# EAGLE design lumyctrl (EAGLE 6.1)
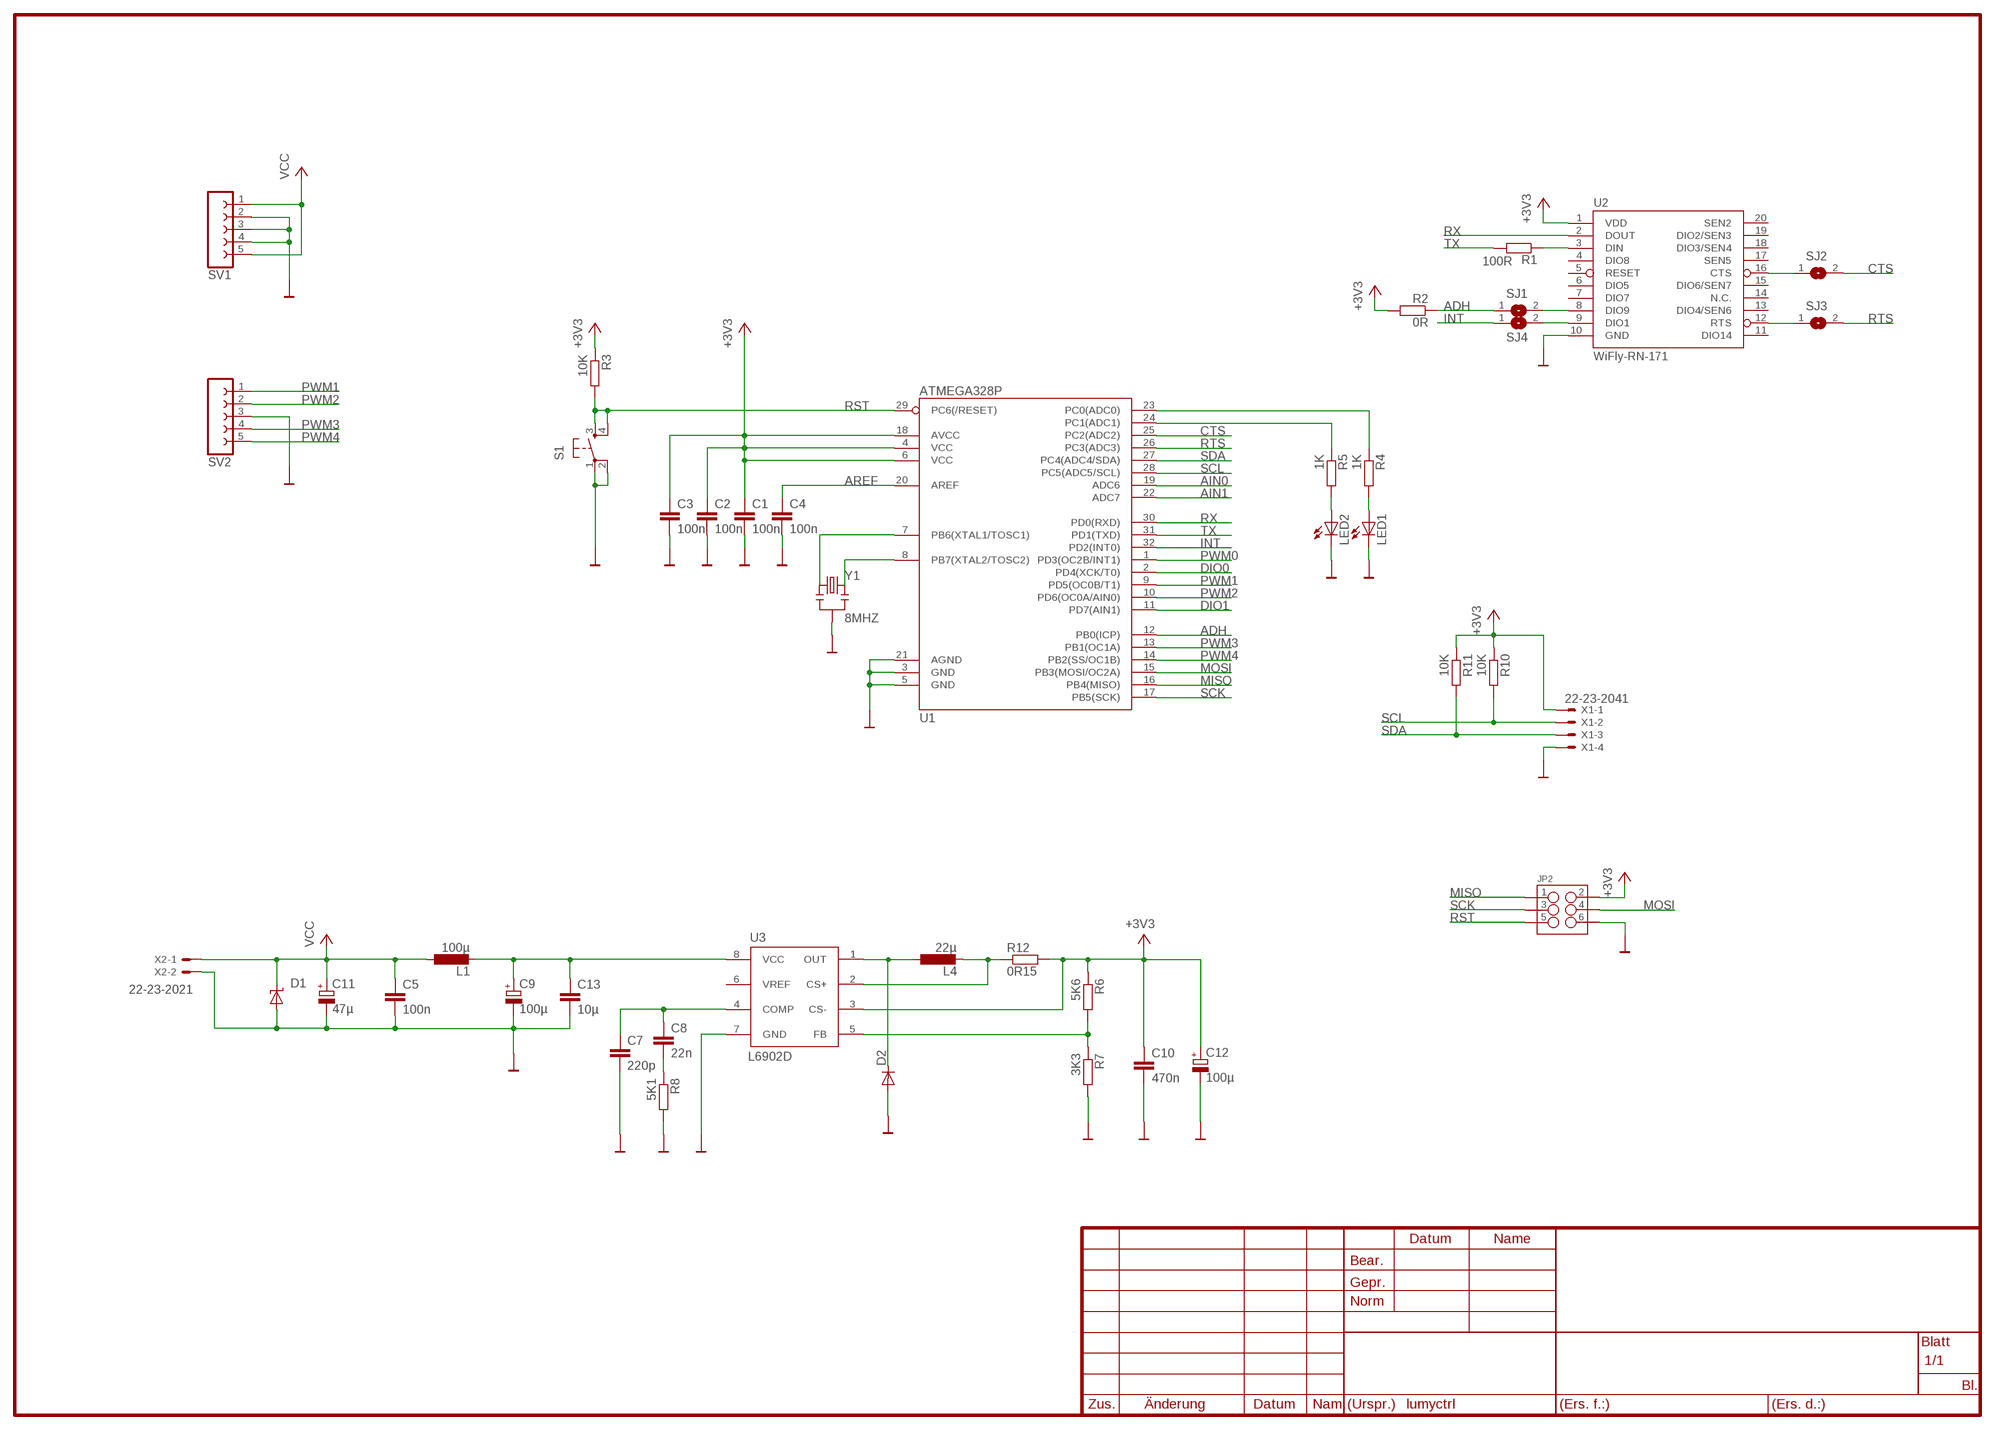
[diagram p0: schematic, sheet 1]

## Parts
C1  100n  C-EUC0603  [C0603]
C2  100n  C-EUC0603  [C0603]
C3  100n  C-EUC0603  [C0603]
C4  100n  C-EUC0603  [C0603]
C5  100n  C-EUC0603  [C0603]
C7  220p  C-EUC0603  [C0603]
C8  22n  C-EUC0603  [C0603]
C9  100µ  CPOL-EUSMCC  [SMC_C]
C10  470n  C-EUC0603  [C0603]
C11  47µ  CPOL-EUSMCE  [SMC_E]
C12  100µ  CPOL-EUSMCC  [SMC_C]
C13  10µ  C-EUC1206  [C1206]
D1  SUPPRESSOR-SMBJ  [SMBJ]
D2  DIODESMA  [SMA-DIODE]
JP2  M03X2SMT  [2X3_SMT_POSTS]
L1  100µ  L-EUWE-TPC  [POWER-CHOKE_WE-TPC]
L4  22µ  L-EUWE-TPC  [POWER-CHOKE_WE-TPC]
LED1  LEDCHIP-LED0603  [CHIP-LED0603]
LED2  LEDCHIP-LED0603  [CHIP-LED0603]
R1  100R  R-EU_R0603  [R0603]
R2  0R  R-EU_R0603  [R0603]
R3  10K  R-EU_R0603  [R0603]
R4  1K  R-EU_R0603  [R0603]
R5  1K  R-EU_R0603  [R0603]
R6  5K6  R-EU_R0603  [R0603]
R7  3K3  R-EU_R0603  [R0603]
R8  5K1  R-EU_R0603  [R0603]
R10  10K  R-EU_R0603  [R0603]
R11  10K  R-EU_R0603  [R0603]
R12  0R15  R-EU_R2512  [R2512]
S1  TAC_SWITCHSMD  [TACTILE_SWITCH_SMD]
SJ1  SJ  [SJ]
SJ2  SJ  [SJ]
SJ3  SJ  [SJ]
SJ4  SJ  [SJ]
SV1  FE05-1  [FE05-1]
SV2  FE05-1  [FE05-1]
U1  ATMEGA328P  ATMEGA328_SMT  [TQFP32-08]
U2  WiFly-RN-171  XBEE-1B3  [XBEE-SMD]
U3  L6902D  [SO08]
X1  22-23-2041  [22-23-2041]
X2  22-23-2021  [22-23-2021]
Y1  8MHZ  RESONATOR8MHZ  [RESONATOR-SMD]

## Nets
+3V3: C1.1 C2.1 C3.1 C10.1 C12.+ JP2.2 R2.2 R3.1 R6.1 R10.1 R11.1 R12.2 U1.4(VCC) U1.6(VCC) U1.18(AVCC) U2.1(VDD) U3.3(CS-) X1.1
ADH: R2.1 SJ1.1 U1.12(PB0(ICP))
AIN0: U1.19(ADC6)
AIN1: U1.22(ADC7)
AREF: C4.1 U1.20(AREF)
CTS: SJ2.2 U1.25(PC2(ADC2))
DIO0: U1.2(PD4(XCK/T0))
DIO1: U1.11(PD7(AIN1))
GND: C1.2 C2.2 C3.2 C4.2 C5.2 C7.2 C9.- C10.2 C11.- C12.- C13.2 D1.A D2.A JP2.6 LED1.C LED2.C R7.2 R8.2 S1.1 S1.2 SV1.2 SV1.3 SV1.4 SV2.3 U1.3(GND) U1.5(GND) U1.21(AGND) U2.10(GND) X1.4 X2.2 Y1.2
INT: SJ4.1 U1.32(PD2(INT0))
MISO: JP2.1 U1.16(PB4(MISO))
MOSI: JP2.4 U1.15(PB3(MOSI/OC2A))
N$1: R1.1 U2.3(DIN)
N$2: SJ1.2 U2.8(DIO9)
N$3: D2.C L4.1 U3.1(OUT)
N$4: U1.7(PB6(XTAL1/TOSC1)) Y1.1
N$5: U1.8(PB7(XTAL2/TOSC2)) Y1.3
N$6: SJ3.1 U2.12(RTS)
N$7: SJ2.1 U2.16(CTS)
N$8: R6.2 R7.1 U3.5(FB)
N$9: C9.+ C13.1 L1.2 U3.8(VCC)
N$10: C7.1 C8.1 U3.4(COMP)
N$11: LED2.A R5.2
N$12: C8.2 R8.1
N$13: LED1.A R4.2
N$14: R4.1 U1.23(PC0(ADC0))
N$15: R5.1 U1.24(PC1(ADC1))
N$16: L4.2 R12.1 U3.2(CS+)
N$17: SJ4.2 U2.9(DIO1)
PWM0: U1.1(PD3(OC2B/INT1))
PWM1: SV2.1 U1.9(PD5(OC0B/T1))
PWM2: SV2.2 U1.10(PD6(OC0A/AIN0))
PWM3: SV2.4 U1.13(PB1(OC1A))
PWM4: SV2.5 U1.14(PB2(SS/OC1B))
RST: JP2.5 R3.2 S1.3 S1.4 U1.29(PC6(/RESET))
RTS: SJ3.2 U1.26(PC3(ADC3))
RX: U1.30(PD0(RXD)) U2.2(DOUT)
SCK: JP2.3 U1.17(PB5(SCK))
SCL: R10.2 U1.28(PC5(ADC5/SCL)) X1.2
SDA: R11.2 U1.27(PC4(ADC4/SDA)) X1.3
TX: R1.2 U1.31(PD1(TXD))
VCC: C5.1 C11.+ D1.C L1.1 SV1.1 SV1.5 X2.1
Unconnected: U2.4(DIO8) U2.5(RESET) U2.6(DIO5) U2.7(DIO7) U2.11(DIO14) U2.13(DIO4/SEN6) U2.14(N.C.) U2.15(DIO6/SEN7) U2.17(SEN5) U2.18(DIO3/SEN4) U2.19(DIO2/SEN3) U2.20(SEN2) U3.6(VREF)

## Power pins joined to a net without a drawn wire
GND: U3.7(GND)

## Library data of the parts
C1-C5 C7 C8 C10 C13 = rcl:C-EU: CAPACITOR, European symbol
C9 C11 C12 = rcl:CPOL-EU: POLARIZED CAPACITOR, European symbol
D1 = diode:SUPPRESSOR-: Suppressor diode
D2 = SparkFun-DiscreteSemi:DIODE: Diode These are standard reverse protection diodes and small signal diodes. SMA package can handle up to about 1A. SOD-323 can handle about 200mA. What the SOD-323 package when ordering, there are some mfgs out there that are 5-pin packages.
JP2 = SparkFun-Connectors:M03X2: 2x3 .1" header. Shrouded, with keying- CONN-10681 SMT- CONN-11415 Pogo pins- HW-11044; PROD_ID: CONN-11415
L1 L4 = rcl:L-EU: INDUCTOR, European symbol
LED1 LED2 = led:LED: LED OSRAM: - CHIPLED LG R971, LG N971, LY N971, LG Q971, LY Q971, LO R971, LY R971 LH N974, LH R974 LS Q976, LO Q976, LY Q976 LO Q996 - Hyper CHIPLED LW Q18S LB Q993, LB Q99A, LB R99A - SideLED LS A670, LO A670, LY A670, LG A670, LP A670 LB A673, LV A673, LT A673, LW A673 LH A674 LY A675 LS A676, LA A676, LO A676, LY A676, LW A676 LS A679, LY A679, LG A679 - Hyper Micro SIDELED® LS Y876, LA Y876, LO Y876, LY Y876 LT Y87S - SmartLED LW L88C, LW L88S LB L89C, LB L89S, LG L890 LS L89K, LO L89K, LY L89K LS L896, LA L896, LO L896, LY L896 - TOPLED LS T670, LO T670, LY T670, LG T670, LP T670 LSG T670, LSP T670, LSY T670, LOP T670, LYG T670 LG T671, LOG T671, LSG T671 LB T673, LV T673, LT T673, LW T673 LH T674 LS T676, LA T676, LO T676, LY T676, LB T676, LH T676, LSB T676, LW T676 LB T67C, LV T67C, LT T67C, LS T67K, LO T67K, LY T67K, LW E67C LS E67B, LA E67B, LO E67B, LY E67B, LB E67C, LV E67C, LT E67C LW T67C LS T679, LY T679, LG T679 LS T770, LO T770, LY T770, LG T770, LP T770 LB T773, LV T773, LT T773, LW T773 LH T774 LS E675, LA E675, LY E675, LS T675 LS T776, LA T776, LO T776, LY T776, LB T776 LHGB T686 LT T68C, LB T68C - Hyper Mini TOPLED® LB M676 - Mini TOPLED Santana® LG M470 LS M47K, LO M47K, LY M47K Source: http://www.osram.convergy.de LUXEON: - LUMILED® LXK2-PW12-R00, LXK2-PW12-S00, LXK2-PW14-U00, LXK2-PW14-V00 LXK2-PM12-R00, LXK2-PM12-S00, LXK2-PM14-U00 LXK2-PE12-Q00, LXK2-PE12-R00, LXK2-PE12-S00, LXK2-PE14-T00, LXK2-PE14-U00 LXK2-PB12-K00, LXK2-PB12-L00, LXK2-PB12-M00, LXK2-PB14-N00, LXK2-PB14-P00, LXK2-PB14-Q00 LXK2-PR12-L00, LXK2-PR12-M00, LXK2-PR14-Q00, LXK2-PR14-R00 LXK2-PD12-Q00, LXK2-PD12-R00, LXK2-PD12-S00 LXK2-PH12-R00, LXK2-PH12-S00 LXK2-PL12-P00, LXK2-PL12-Q00, LXK2-PL12-R00 Source: www.luxeon.com KINGBRIGHT: KA-3528ASYC Source: www.kingbright.com
R1-R8 R10 R11 = resistor:R-EU_: RESISTOR, European symbol
R12 = rcl:R-EU_: RESISTOR, European symbol
S1 = SparkFun-Electromechanical:TAC_SWITCH: Momentary Switch Button commonly used for reset or general input. Spark Fun Electronics SKU : COM-00097 SMT- SWCH-08247; PROD_ID: SWCH-08247
SJ1-SJ4 = jumper:SJ: SMD solder JUMPER
SV1 SV2 = con-lsta:FE05-1: FEMALE HEADER; OC_FARNELL: unknown; OC_NEWARK: unknown
U1 = SparkFun-DigitalIC:ATMEGA328_SMT: 32-Pin Atmega328 part Commonly used on Arduino compatible boards Available in QFP and QFN packages TQFP is IC-09069 QFN is non-stock; PROD_ID: IC-09069
U2 = SparkFun-RF:XBEE-1: Xbee module footprints SMT header is CONN-09042.; PROD_ID: CONN-09042
U3 = st-microelectronics-2:L6902D: 1A Switching Regulator with adjustable Current Limit
X1 = con-molex:22-23-2041: .100" (2.54mm) Center Header - 4 Pin; MF: MOLEX; MPN: 22-23-2041; OC_FARNELL: 1462920; OC_NEWARK: 38C0355
X2 = con-molex:22-23-2021: .100" (2.54mm) Center Header - 2 Pin; MF: MOLEX; MPN: 22-23-2021; OC_FARNELL: 1462926; OC_NEWARK: 25C3832
Y1 = SparkFun-FreqCtrl:RESONATOR: Resonator Small SMD resonator. Used, eg, on the Arduino Pro/ Pro Mini boards. 8MHz- XTAL-08895 16MHz- XTAL-08900; PROD_ID: XTAL-08895

## Board
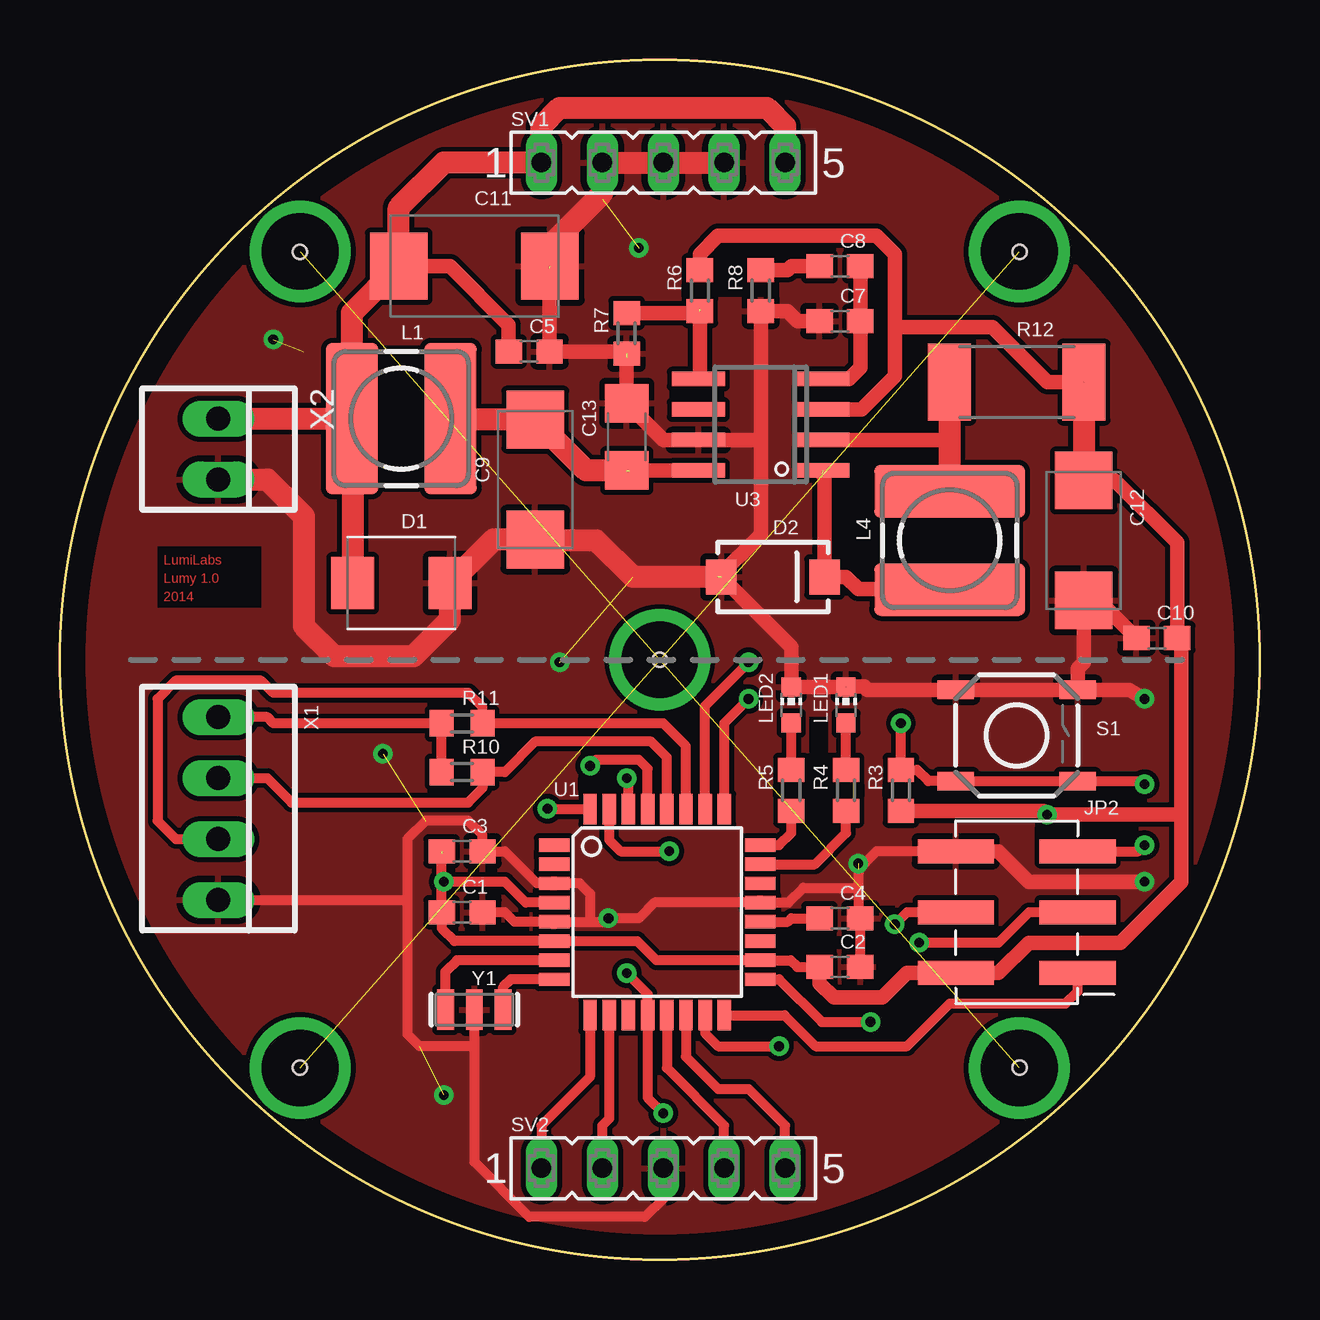
[diagram p1: board, top side]
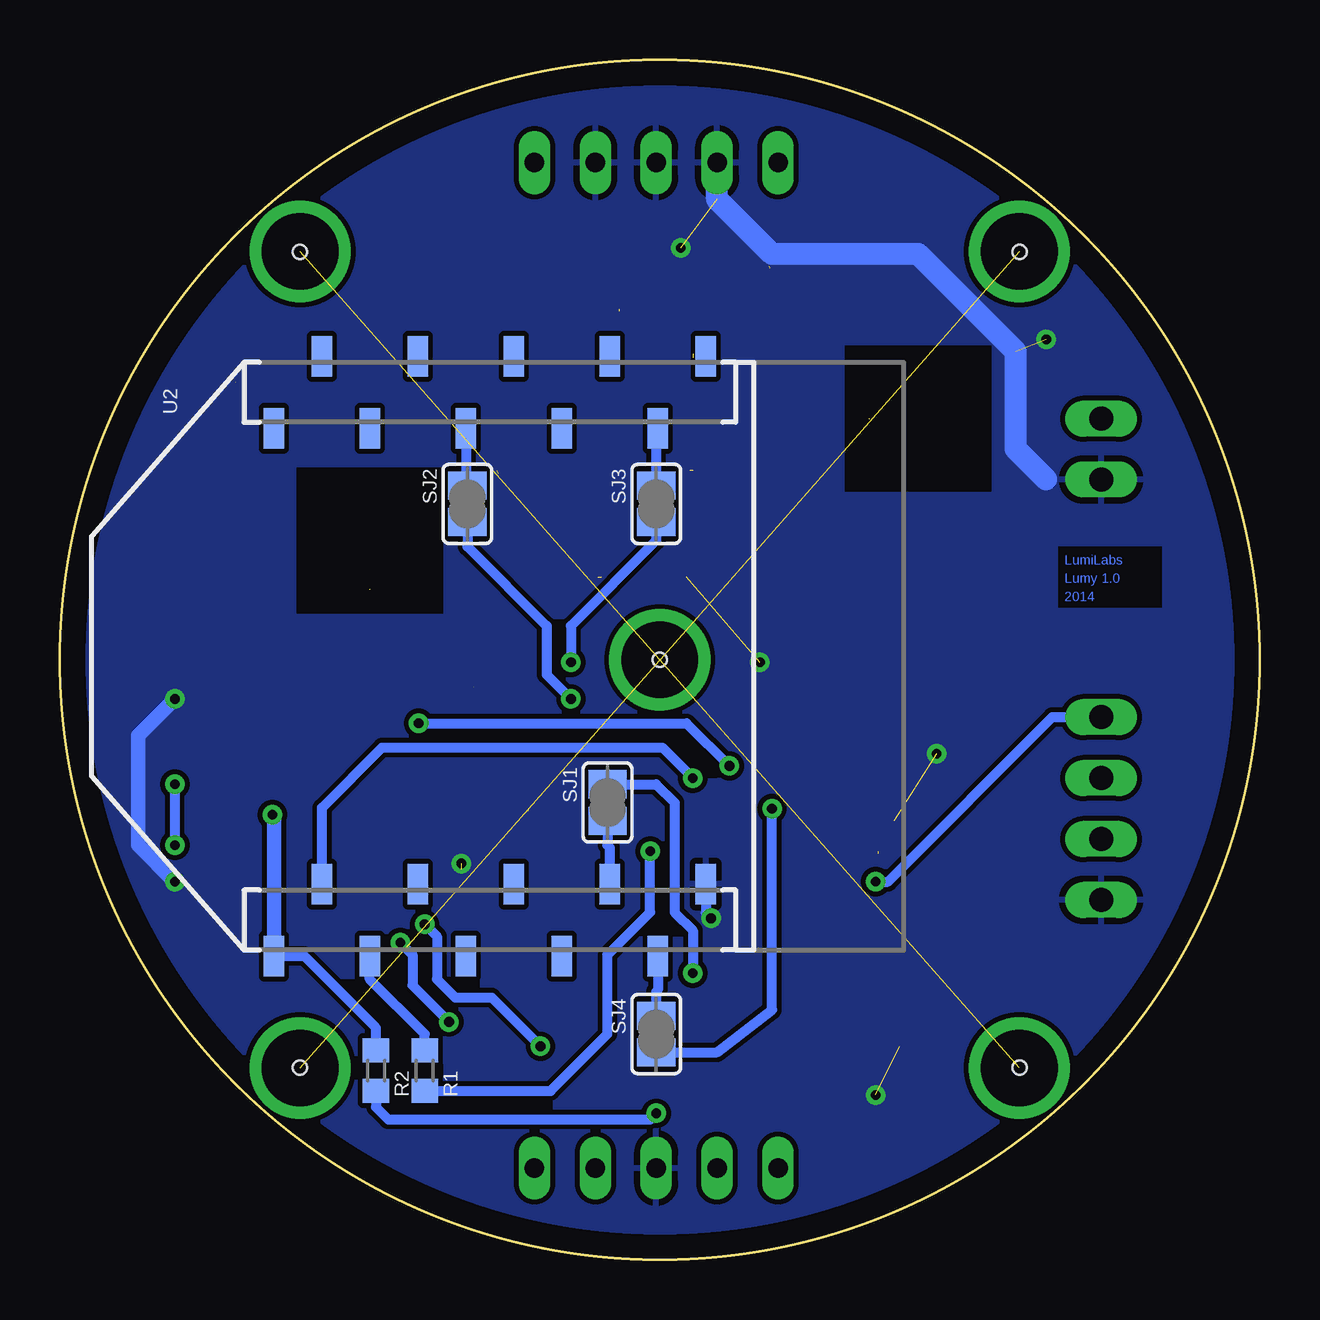
[diagram p2: board, bottom side, seen from below]

Size 50 x 50 mm. Coordinates in mm from the lower left corner, seen from the top.
Outline: circle at 25,25 radius 25
Copper layers (1*16): Top 0.035mm / dielectric 1.5mm / Bottom 0.035mm
Design rules: minimum track width 10mil, minimum drill 10mil, track to track 8mil, track to pad 8mil, pad to pad 8mil, via to via 8mil, smd to smd 8mil, copper to edge 40mil, drill to drill 8mil, minimum pad ring 10mil, minimum via ring 8mil, stop-mask expansion 4mil, vias tented up to drill 0mil, thermal gap 10mil
Holes 0.6 mm at 25,25 40,8 10,8 10,42 40,42
tRestrict: area 4.1,27.2 to 8.4,29.7; area 11.2,32 to 17.3,38.1; area 34,26.9 to 40.1,33; area 16.8,11.4 to 18,11.9; area 18.5,13.7 to 19.6,14.5; area 34,11.9 to 34.8,13.5; area 30.2,13 to 34,13.5; area 34.3,14.5 to 34.8,14.7; area 40.6,17.5 to 45,18; area 34.3,19.3 to 36.6,19.8; area 28.4,10.7 to 30.2,11.2; area 28.2,10.7 to 28.4,10.9; area 30.5,33 to 36.6,33.8; area 30.5,35.8 to 33.3,36.3; area 25.9,40.1 to 30,40.6; area 30.5,34.5 to 33.3,35.1; area 29.7,19.3 to 33.5,19.8; area 31.2,19.8 to 32,22.6; area 21.6,19.6 to 22.6,20.1; area 25.4,35.8 to 27.7,36.3
bRestrict: area 4.1,27.2 to 8.4,29.7; area 34,26.9 to 40.1,33; area 11.2,32 to 17.3,38.1; area 24.6,13.5 to 25.1,16.8; area 24.1,13.5 to 24.6,14; area 24.1,21.6 to 34.8,22.1; area 22.6,20.1 to 23.1,20.6; area 29,25.1 to 29.5,26.7; area 34,7.6 to 37.3,8.1; area 37.6,11.4 to 38.4,11.7; area 29.5,6.1 to 34,6.9; area 32.5,11.2 to 33.5,11.7

### Footprints (pad centres in the part's own frame; a part is rotated, then mirrored left to right if it is on the bottom)
C0603 = smd 1.1 x 1: 1 -0.85,0; 2 0.85,0
SMC_C = smd 2.4 x 2.4: + -2.5,0; - 2.5,0
SMC_E = smd 2.4 x 2.8: + -3.15,0; - 3.15,0
C1206 = smd 1.6 x 1.8: 1 -1.4,0; 2 1.4,0
SMBJ = smd 1.78 x 2.16: A 2.04,0; C -2.03,0
SMA-DIODE = smd 1.27 x 1.47: A -2.15,0; C 2.15,0
2X3_SMT_POSTS = smd 1 x 3.17: 1 -2.54,-2.54; 2 -2.54,2.54; 3 0,-2.54; 4 0,2.54; 5 2.54,-2.54; 6 2.54,2.54
POWER-CHOKE_WE-TPC = smd 6.3 x 2.2: 1 0,2.05; 2 0,-2.05
CHIP-LED0603 = smd 0.8 x 0.8: A 0,-0.75; C 0,0.75
R0603 = smd 1 x 1.1: 1 -0.85,0; 2 0.85,0
R2512 = smd 1.8 x 3.2: 1 -2.8,0; 2 2.8,0
TACTILE_SWITCH_SMD = smd 1.524 x 0.762: 1 -2.54,1.905; 2 2.54,1.905; 3 -2.54,-1.905; 4 2.54,-1.905
SJ = smd 1.168 x 1.6: 1 -0.762,0; 2 0.762,0
FE05-1 = drill 0.813 long: 1 -5.08,0; 2 -2.54,0; 3 0,0; 4 2.54,0; 5 5.08,0
TQFP32-08 = smd 1.27 x 0.559: 1 -4.293,2.8; 2 -4.293,2; 3 -4.293,1.2; 4 -4.293,0.4; 5 -4.293,-0.4; 6 -4.293,-1.2; 7 -4.293,-2; 8 -4.293,-2.8; 17 4.293,-2.8; 18 4.293,-2; 19 4.293,-1.2; 20 4.293,-0.4; 21 4.293,0.4; 22 4.293,1.2; 23 4.293,2; 24 4.293,2.8 | smd 0.559 x 1.27: 9 -2.8,-4.293; 10 -2,-4.293; 11 -1.2,-4.293; 12 -0.4,-4.293; 13 0.4,-4.293; 14 1.2,-4.293; 15 2,-4.293; 16 2.8,-4.293; 25 2.8,4.293; 26 2,4.293; 27 1.2,4.293; 28 0.4,4.293; 29 -0.4,4.293; 30 -1.2,4.293; 31 -2,4.293; 32 -2.8,4.293
XBEE-SMD = smd 1.7 x 0.85: 1 -12.5,20; 2 -9.5,18; 3 -12.5,16; 4 -9.5,14; 5 -12.5,12; 6 -9.5,10; 7 -12.5,8; 8 -9.5,6; 9 -12.5,4; 10 -9.5,2; 11 12.5,2; 12 9.5,4; 13 12.5,6; 14 9.5,8; 15 12.5,10; 16 9.5,12; 17 12.5,14; 18 9.5,16; 19 12.5,18; 20 9.5,20
SO08 = smd 0.6 x 2.2: 1 -1.905,-2.6; 2 -0.635,-2.6; 3 0.635,-2.6; 4 1.905,-2.6; 5 1.905,2.6; 6 0.635,2.6; 7 -0.635,2.6; 8 -1.905,2.6
22-23-2041 = drill 1 long: 1 -3.81,0; 2 -1.27,0; 3 1.27,0; 4 3.81,0
22-23-2021 = drill 1 long: 1 -1.27,0; 2 1.27,0
RESONATOR-SMD = smd 0.7 x 1.7: 1 -1.2,0; 2 0,0; 3 1.2,0

### Placement (x,y rotation side)
C1  16.76,14.48 0 top
C2  32.51,12.19 0 top
C3  16.76,17.02 0 top
C4  32.51,14.22 0 top
C5  19.56,37.85 0 top
C7  32.51,39.12 180 top
C8  32.51,41.4 180 top
C9  19.81,32.51 270 top
C10  45.72,25.91 180 top
C11  17.27,41.4 0 top
C12  42.67,29.97 270 top
C13  23.62,34.29 90 top
D1  14.22,28.19 0 top
D2  29.72,28.45 0 top
JP2  39.88,14.48 90 top
L1  14.22,35.05 90 top
L4  37.08,29.97 180 top
LED1  32.77,23.11 0 top
LED2  30.48,23.11 0 top
R1  34.8,7.87 270 bottom
R2  36.83,7.87 90 bottom
R3  35.05,19.56 90 top
R4  32.77,19.56 90 top
R5  30.48,19.56 90 top
R6  26.67,40.39 270 top
R7  23.62,38.61 270 top
R8  29.21,40.39 270 top
R10  16.76,20.32 0 top
R11  16.76,22.35 0 top
R12  39.88,36.58 0 top
S1  39.88,21.84 0 top
SJ1  27.18,19.05 270 bottom
SJ2  33.02,31.5 270 bottom
SJ3  25.15,31.5 270 bottom
SJ4  25.15,9.4 90 bottom
SV1  25.15,45.72 0 top
SV2  25.15,3.81 0 top
U1  24.89,14.48 0 top
U2  21.08,25.15 90 bottom
U3  29.21,34.8 90 top
X1  6.6,18.8 270 top
X2  6.6,33.78 270 top
Y1  17.27,10.41 0 top

### Tracks (layer width: path | path; a pad name or v marks a point on that pad's centre or on a via)
+3V3  (via drill 0.41)  (2 unrouted)
  Top 0.406: C2.1 30.73,12.19 30.45,12.48 U1.18 24.86,12.48 24.06,13.28 U1.6 16.44,13.28 15.91,13.8 C1.1 15.91,15.75 | U1.4 19.41,14.88 18.54,15.75 v16,15.75 15.91,15.75 | 16,17.02 15.91,16.93 15.91,15.75 | X1.1 8.64,22.61 8.89,22.35 R11.1 R10.1
  Top 0.61: R6.1 26.67,41.91 27.43,42.67 34.04,42.67 34.8,41.91 34.8,38.86 | U3.3 33.4,35.43 34.8,36.83 34.8,38.86 | 34.8,38.86 38.86,38.86 41.15,36.58 R12.2 | C12.+ 43.98,32.48 46.57,29.88 C10.1 46.74,25.74 46.74,18.54 | 46.74,18.54 v41.15,18.54 40.98,18.71 R3.1 | 46.74,18.54 46.74,15.75 44.2,13.21 40.39,13.21 39.12,11.94 JP2.2 35.31,11.94 34.29,10.92 32.26,10.92 31.66,11.52 C2.1
  Top 0.813: C12.+
  Top 0.914: R12.2 C12.+
  Bottom 0.406: v16,15.75 15.49,15.75 8.64,22.61 X1.1 | R2.2 36.83,9.65 39.82,12.65 U2.1
  Bottom 0.61: U2.1 41.08,18.48 v41.15,18.54
ADH  (via drill 0.41)
  Top 0.406: v25.15,6.1 24.49,6.75 U1.12 24.49,11.07 v23.62,11.94
  Bottom 0.406: SJ1.1 25.15,19.81 24.38,19.05 24.38,14.48 23.62,13.72 v23.62,11.94 | R2.1 36.83,6.35 36.32,5.84 25.4,5.84 v25.15,6.1
AREF
  Top 0.406: U1.20 30.33,14.08 30.48,14.22 C4.1
CTS  (via drill 0.41)
  Top 0.406: U1.25 27.69,22.36 v28.7,23.37
  Bottom 0.406: SJ2.2 33.02,29.72 29.72,26.42 29.72,24.38 v28.7,23.37
GND  (via drill 0.41)  (10 unrouted)
  Top 0.406: JP2.6 34.04,17.02 33.27,16.26 33.27,15.49 | 33.27,15.49 33.27,14.31 C4.2 C2.2 | 22.1,14.08 U1.5 18.94,14.08 18.54,14.48 C1.2 | 22.1,14.08 22.71,14.08 v22.86,14.22 24.13,14.22 24.78,14.88 U1.21 30.37,14.88 30.99,15.49 33.27,15.49 | 22.1,14.08 22.1,15.24 21.66,15.68 U1.3 19.88,15.68 18.54,17.02 C3.2 17.61,17.69 17.02,18.29 15.24,18.29 14.48,17.53 14.48,14.99 | 14.48,14.99 14.48,9.4 14.99,8.89 17.27,8.89 | SV2.3 25.15,2.54 24.38,1.78 19.56,1.78 17.27,4.06 17.27,8.89 | 17.27,8.89 Y1.2 | X1.4 14.48,14.99
  Top 0.61: C5.2 23.37,37.85 23.62,37.59 C13.2 25.15,34.16 U3.7 29.08,34.16 29.21,34.04 | C5.2 20.57,37.85 | C5.2 20.41,41.31 | 29.21,34.04 R8.2 30.31,39.54 30.73,39.12 C7.2 | 29.21,34.04 29.21,30.23 27.43,28.45 | C12.- 42.67,24.89 42.42,24.64 S1.2 | 19.85,29.97 C9.- | D2.A 30.48,25.54 LED2.C 32.75,23.86 32.77,23.88 | LED1.C 32.78,23.88 33.53,23.88 33.66,23.75 S1.1 S1.2 | JP2.6 39.12,17.02 40.39,15.75 v45.21,15.75 | S1.2 44.58,23.75 v45.21,23.37 | 42.8,27.6 43.18,27.6 C10.2
  Top 0.813: 42.8,27.6 C12.-
  Top 0.914: SV1.4 SV1.3 SV1.2 22.61,44.45 20.42,42.27 C11.- | C9.- 18.08,30.01 D1.A 16.26,26.67 14.73,25.15 11.43,25.15 10.16,26.42 10.16,30.99 8.64,32.51 X2.2 | D2.A 23.88,28.45 22.35,29.97 19.85,29.97
  Bottom 0.406: U2.10 23.08,14.45 v22.86,14.22
  Bottom 0.61: v45.21,23.37 46.74,21.84 46.74,17.27 v45.21,15.75
  Bottom 0.914: 8.89,32.51 10.16,33.78 10.16,37.85 14.22,41.91 20.32,41.91 22.61,44.2 SV1.2
  other vias: 20.83,24.89 24.13,42.16 16,6.86 33.27,16.51 8.89,38.35 13.46,21.08
  pour Top: 0.25,24.89 arc-90 25.15,49.78 25.4,49.78 arc-90 49.78,25.4 49.78,24.64 arc-90 25.4,0.25 24.89,0.25 arc-90
  pour Bottom: 0.25,24.89 arc-90 25.15,49.78 25.4,49.78 arc-90 49.78,25.4 49.78,24.64 arc-90 25.4,0.25 24.89,0.25 arc-90
INT  (via drill 0.41)
  Top 0.406: U1.32 20.32,18.77 v20.32,18.8
  Bottom 0.406: SJ4.1 22.61,8.64 20.32,10.41 v20.32,18.8
MISO
  Top 0.406: JP2.1 42.42,11.18 41.91,10.67 37.08,10.67 35.31,8.89 31.5,8.89 30.2,10.19 U1.16
MOSI  (via drill 0.41)
  Top 0.406: JP2.4 35.31,14.48 v34.8,13.97 | U1.15 26.89,9.43 27.43,8.89 v29.97,8.89
  Bottom 0.406: v34.8,13.97 34.29,13.46 34.29,11.68 33.53,10.92 32,10.92 v29.97,8.89
N$1
  Bottom 0.406: R1.1 34.8,9.4 37.08,11.68 U2.3
N$2
  Bottom 0.406: SJ1.2 27.18,17.27 27.08,17.18 U2.8
N$3  (2 unrouted)
  Top 0.61: 31.75,32.77 31.87,32.65 D2.C 32.77,28.45 33.27,27.94 37.08,27.94
N$4
  Top 0.406: Y1.1 16.07,12.01 16.54,12.48 U1.7
N$5
  Top 0.406: Y1.3 18.47,11.36 18.8,11.68 U1.8
N$6
  Bottom 0.406: U2.12 25.08,34.73 25.15,34.8 SJ3.1
N$7
  Bottom 0.406: U2.16 33.08,32.32 SJ2.1
N$8  (1 unrouted)
  Top 0.61: R7.1 26.5,39.46 26.67,39.62 | U3.5 26.61,36.77 26.67,36.83 R6.2
N$9  (2 unrouted)
  Top 0.61: U3.8 23.75,32.89 23.62,33.02
  Top 0.914: 16.26,35.05 16.3,35.01 C9.+ 21.93,32.89 C13.1
N$10
  Top 0.61: U3.4 32.89,36.7 33.36,37.17 C7.1 C8.1
N$11
  Top 0.406: R5.2 LED2.A
N$12
  Top 0.61: R8.1 30.31,41.24 30.48,41.4 C8.2
N$13
  Top 0.406: R4.2 LED1.A
N$14
  Top 0.406: U1.23 31.46,16.48 32.77,17.78 R4.1
N$15  (1 unrouted)
  Top 0.406: U1.24 29.98,17.28 30.48,17.78 30.48,18.8
N$16
  Top 0.61: L4.2 | U3.2 36.95,34.16 37.08,34.04
  Top 0.914: R12.1 37.08,34.04 L4.2
N$17
  Bottom 0.406: U2.9 25.08,11.24 25.15,11.18 SJ4.2
N$18  (via drill 3.2)  (4 unrouted)
  other vias: 25,25 39.99,42.02 39.99,42.02 10.01,42.02 10.01,7.98 39.99,7.98
PWM1
  Top 0.406: U1.9 22.09,7.61 20.07,5.59 SV2.1
PWM2
  Top 0.406: SV2.2 22.61,5.59 22.89,5.87 U1.10
PWM3
  Top 0.406: SV2.4 27.69,5.59 25.29,7.98 U1.13
PWM4
  Top 0.406: SV2.5 30.23,5.59 28.7,7.11 27.43,7.11 26.09,8.45 U1.14
RST  (via drill 0.41)
  Top 0.406: U1.29 24.49,20.47 24.13,20.83 22.35,20.83 v22.1,20.57 | v35.05,22.35 R3.2 35.73,20.41 36.2,19.94 S1.3 S1.4 45.09,19.94 v45.21,19.81 | JP2.5 44.96,17.02 v45.21,17.27
  Bottom 0.406: v35.05,22.35 23.88,22.35 v22.1,20.57 | v45.21,19.81 v45.21,17.27
RTS  (via drill 0.41)
  Top 0.406: U1.26 26.89,23.08 v28.7,24.89
  Bottom 0.406: SJ3.2 25.15,29.97 28.7,26.42 v28.7,24.89
RX  (via drill 0.41)
  Top 0.406: U1.30 23.69,20 v23.62,20.07
  Bottom 0.406: U2.2 39.08,18.83 36.58,21.34 24.89,21.34 v23.62,20.07
SCK  (via drill 0.41)
  Top 0.406: JP2.3 40.39,14.48 39.12,13.21 v35.81,13.21 | U1.17 29.98,11.68 31.75,9.91 v33.78,9.91
  Bottom 0.406: v35.81,13.21 35.31,12.7 35.31,11.43 v33.78,9.91
SCL
  Top 0.406: U1.28 25.29,20.94 24.64,21.59 19.81,21.59 18.54,20.32 R10.2 17.61,19.65 17.02,19.05 9.65,19.05 8.64,20.07 X1.2
SDA
  Top 0.406: U1.27 26.09,21.41 25.15,22.35 R11.2 17.61,23.03 17.02,23.62 8.89,23.62 8.38,24.13 4.83,24.13 4.06,23.37 4.06,18.29 4.83,17.53 X1.3
TX  (via drill 0.41)
  Top 0.406: U1.31 22.89,17.49 23.37,17.02 v25.4,17.02
  Bottom 0.406: v25.4,17.02 25.4,14.48 27.18,12.7 27.18,9.4 29.55,7.02 R1.2
VCC
  Top 0.61: C11.+ 16.26,41.4 18.71,38.95 C5.1
  Top 0.914: L1.1 12.17,39.45 C11.+ 14.12,43.84 16,45.72 SV1.1 20.07,47.24 20.83,48.01 29.46,48.01 30.23,47.24 SV1.5 | L1.1 12.19,35.05 D1.C | X2.1 L1.1

### Text on the board
Top: LumiLabs | Lumy 1.0 | 2014
Bottom: LumiLabs | Lumy 1.0 | 2014